# Altium schematic sheet Watch Design_2022-04-19.schdoc
size 423 x 188 mm
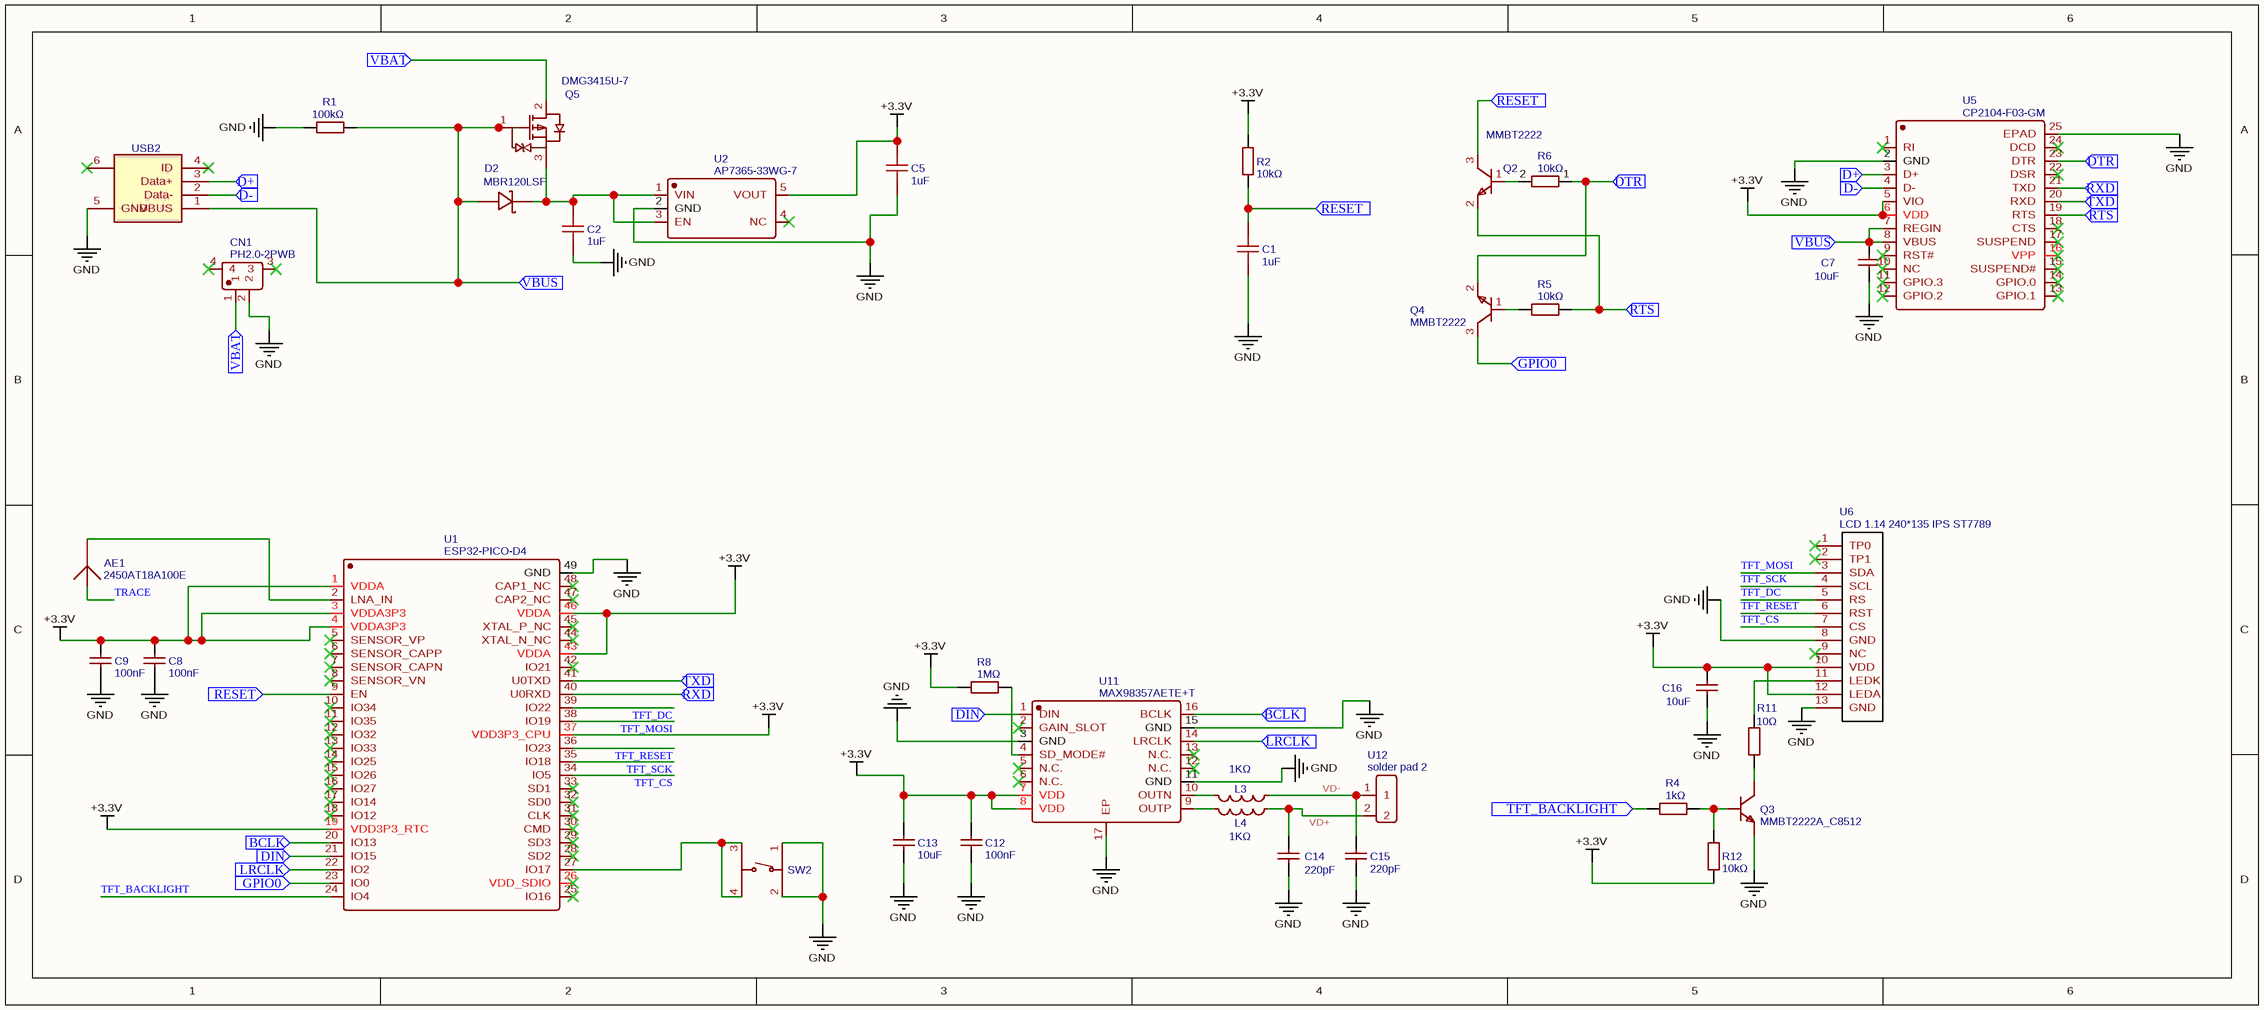
[diagram p0: Watch Design_2022-04-19.schdoc]

## Parts
AE1  2450AT18A100E  [ANT-SMD_L3.2-W1.6]
C1  1uF  [C0603]
C2  1uF  [C0402]
C5  1uF  [C0402]
C7  10uF  [C0402]
C8  100nF  [C0402]
C9  100nF  [C0402]
C12  100nF  [C0402]
C13  10uF  [C0402]
C14  220pF  [C0402]
C15  220pF  [C0402]
C16  10uF  [C0402]
CN1  PH2.0-2PWB  [CONN-SMD_2P-P2.00_PH2.0-SPWB]
D2  MBR120LSF  [SOD-123_L2.8-W1.8-LS3.7-RD]
L3  1KΩ  [L0603]
L4  1KΩ  [L0603]
Q2  MMBT2222  [SOT-23-3_L2.9-W1.4-P1.91-LS2.6-BR]
Q3  MMBT2222A_C8512  [SOT-23-3_L2.9-W1.3-P1.90-LS2.4-BR]
Q4  MMBT2222  [SOT-23-3_L2.9-W1.4-P1.91-LS2.6-BR]
Q5  DMG3415U-7  [SOT-23-3_L2.9-W1.6-P1.90-LS2.8-BR-CW]
R1  100kΩ  [R0402]
R2  10kΩ  [R0402]
R4  1kΩ  [R0402]
R5  10kΩ  [R0402]
R6  10kΩ  [R0402]
R8  1MΩ  [R0402]
R11  10Ω  [R0402]
R12  10kΩ  [R0402]
SW2  TS-1187A-B-A-B  [SW-SMD_4P-L5.1-W5.1-P3.70-LS6.5-TL-2]  (value not drawn)
U1  ESP32-PICO-D4  [QFN-48_L7.0-W7.0-P0.50-BL-EP5.4]
U2  AP7365-33WG-7  [SOT-25_L3.0-W1.6-P0.95-LS2.8-BR]
U5  CP2104-F03-GM  [QFN-24_L4.0-W4.0-P0.50-BL-EP2.7]
U6  LCD 1.14 240*135 IPS ST7789  [LCD_1.14_240*135_IPS_ST7789]
U11  MAX98357AETE+T  [TQFN-16_L3.0-W3.0-P0.50-BL-EP1.5]
U12  solder pad 2  [SOLDER PADS]
USB2  47346-0001  [MICRO-USB-SMD_47346-0001]  (value not drawn)

## Ports
BCLK (in), D+ (in), D- (in), DIN (in), DTR (in), GPIO0 (in), LRCLK (in), RESET (in), RTS (in), RXD (in), TFT_BACKLIGHT (in), TXD (in), VBAT (in), VBUS (in)

## Nets
+3.3V: C5.2 C8.2 C9.2 C12.2 C13.2 C16.2 R2.2 R8.1 R12.1 U1.1(VDDA) U1.3(VDDA3P3) U1.4(VDDA3P3) U1.19(VDD3P3_RTC) U1.37(VDD3P3_CPU) U1.43(VDDA) U1.46(VDDA) U2.5(VOUT) U5.5(VIO) U5.6(VDD) U6.10(VDD) U6.12(LEDA) U11.7(VDD) U11.8(VDD)
GND: C1.1 C2.1 C5.1 C7.1 C8.1 C9.1 C12.1 C13.1 C14.1 C15.1 C16.1 CN1.2 Q3.2(E) R1.1 SW2.1(A) SW2.2(B) U1.49(GND) U2.2(GND) U5.2(GND) U5.25(EPAD) U6.8(GND) U6.13(GND) U11.3(GND) U11.11(GND) U11.15(GND) U11.17(EP) USB2.5(GND)
BCLK: U1.20(IO13) U11.16(BCLK) ; port BCLK
D+: U5.3(D+) USB2.3(Data+) ; port D+
D-: U5.4(D-) USB2.2(Data-) ; port D-
DIN: U1.21(IO15) U11.1(DIN) ; port DIN
DTR: Q4.2(E) R6.1 U5.23(DTR) ; port DTR
GPIO0: Q4.3(C) U1.23(IO0) ; port GPIO0
LRCLK: U1.22(IO2) U11.14(LRCLK) ; port LRCLK
RESET: C1.2 Q2.3(C) R2.1 U1.9(EN) ; port RESET
RTS: Q2.2(E) R5.1 U5.19(RTS) ; port RTS
RXD: U1.40(U0RXD) U5.21(TXD) ; port RXD
TFT_BACKLIGHT: U1.24(IO4)
TFT_BACKLIGHT: R4.1 ; port TFT_BACKLIGHT  [a separate net that carries the same name]
TFT_CS: U1.34(IO5) U6.7(CS)
TFT_DC: U1.39(IO22) U6.5(RS)
TFT_MOSI: U1.38(IO19) U6.3(SDA)
TFT_RESET: U1.36(IO23) U6.6(RST)
TFT_SCK: U1.35(IO18) U6.4(SCL)
TRACE: AE1.2
TXD: U1.41(U0TXD) U5.20(RXD) ; port TXD
VBAT: CN1.1 Q5.2(D) ; port VBAT
VBUS: C7.2 D2.2(A) Q5.1(G) R1.2 U5.7(REGIN) U5.8(VBUS) USB2.1(VBUS) ; port VBUS
NetAE1_1: AE1.1(ANT) U1.2(LNA_IN)
NetC2_2: C2.2 D2.1(C) Q5.3(S) U2.1(VIN) U2.3(EN)
NetC14_2: C14.2 L4.1 U12.2
NetC15_2: C15.2 L3.1 U12.1
NetL3_2: L3.2 U11.10(OUTN)
NetL4_2: L4.2 U11.9(OUTP)
NetQ2_1: Q2.1(B) R6.2
NetQ3_1: Q3.1(B) R4.2 R12.2
NetQ3_3: Q3.3(C) R11.1
NetQ4_1: Q4.1(B) R5.2
NetR8_2: R8.2 U11.4(SD_MODE#)
NetR11_2: R11.2 U6.11(LEDK)
NetSW2_3: SW2.3(C) SW2.4(D) U1.27(IO17)

Not connected (* = marked no-connect by the designer): CN1 3* 4*; U1 5(SENSOR_VP)* 6(SENSOR_CAPP)* 7(SENSOR_CAPN)* 8(SENSOR_VN)* 10(IO34)* 11(IO35)* 12(IO32)* 13(IO33)* 14(IO25)* 15(IO26)* 16(IO27)* 17(IO14)* 18(IO12)* 25(IO16)* 26(VDD_SDIO)* 28(SD2)* 29(SD3)* 30(CMD)* 31(CLK)* 32(SD0)* 33(SD1)* 42(IO21)* 44(XTAL_N_NC)* 45(XTAL_P_NC)* 47(CAP2_NC)* 48(CAP1_NC)*; U2 4(NC)*; U5 1(RI)* 9(RST#)* 10(NC)* 11(GPIO.3)* 12(GPIO.2)* 13(GPIO.1)* 14(GPIO.0)* 15(SUSPEND#)* 16(VPP)* 17(SUSPEND)* 18(CTS)* 22(DSR)* 24(DCD)*; U6 1(TP0)* 2(TP1)* 9(NC)*; U11 2(GAIN_SLOT)* 5(N.C.)* 6(N.C.)* 12(N.C.)* 13(N.C.)*; USB2 4(ID)* 6*

## Notes on the sheet
- VD+
- VD-

## Library data of the parts
AE1 = 2450AT18A100E: BOM_Manufacturer: Johanson Dielectrics; Contributor: LCSC; BOM_Supplier: LCSC; BOM_Supplier Part: C89334; BOM_Manufacturer Part: 2450AT18A100E; BOM_JLCPCB Part Class: Extended Part; spicePre: A; spiceSymbolName: 2450AT18A100E
C1 = 1uF: BOM_Manufacturer: Samwha Capacitor; BOM_Manufacturer Part: CS1608X7R105K250NRB; nameAlias: Capacitance; Contributor: LCSC; BOM_Supplier: LCSC; BOM_Supplier Part: C513775; BOM_JLCPCB Part Class: Extended Part; spicePre: C; spiceSymbolName: CS1608X7R105K250NRB
C2 C5 = 1uF: BOM_Manufacturer: Walsin Tech Corp; BOM_Manufacturer Part: 0402F105M6R3CT; nameAlias: Capacitance; Contributor: LCSC; BOM_Supplier: LCSC; BOM_Supplier Part: C408910; BOM_JLCPCB Part Class: Extended Part; spicePre: C; spiceSymbolName: 0402F105M6R3CT
C7 C13 C16 = 10uF: BOM_Manufacturer Part: CL05A106MQ5NUNC; BOM_Manufacturer: SAMSUNG; nameAlias: Capacitance; BOM_Supplier: LCSC; BOM_Supplier Part: C15525; BOM_JLCPCB Part Class: Basic Part; spicePre: C; spiceSymbolName: CL05A106MQ5NUNC
C8 C9 C12 = 100nF: BOM_Manufacturer: FH; BOM_Manufacturer Part: 0402F104M500NT; nameAlias: Capacitance; BOM_Supplier: LCSC; BOM_Supplier Part: C1581; BOM_JLCPCB Part Class: Extended Part; spicePre: C; spiceSymbolName: 0402F104M500NT
C14 C15 = 220pF: BOM_Manufacturer: FH; BOM_Manufacturer Part: 0402B221K500NT; nameAlias: Capacitance; BOM_Supplier: LCSC; BOM_Supplier Part: C1530; BOM_JLCPCB Part Class: Basic Part; spicePre: C; spiceSymbolName: 0402B221K500NT
CN1 = PH2.0-2PWB: BOM_Manufacturer: BOOMELE; BOM_Manufacturer Part: PH2.0-2PWB Horizontal; BOM_Supplier: LCSC; BOM_Supplier Part: C47647; BOM_JLCPCB Part Class: Extended Part; spicePre: C; spiceSymbolName: PH2.0-2PWB
D2 = MBR120LSF: BOM_Manufacturer: SK; Contributor: LCSC; BOM_Supplier: LCSC; BOM_Manufacturer Part: MBR120LSF; BOM_Supplier Part: C130880; BOM_JLCPCB Part Class: Extended Part; spicePre: D; spiceSymbolName: MBR120LSF
L3 L4 = 1KΩ: BOM_Manufacturer: MuRata; BOM_Manufacturer Part: BLM18AG102SN1D; nameAlias: Value; BOM_Supplier: LCSC; BOM_Supplier Part: C85824; BOM_JLCPCB Part Class: Extended Part; spicePre: L; spiceSymbolName: BLM18AG102SN1D
Q2 Q4 = MMBT2222: BOM_Manufacturer: YONGYUTAI(永裕泰); Contributor: LCSC; BOM_Supplier: LCSC; BOM_Supplier Part: C2891810; BOM_Manufacturer Part: MMBT2222; spicePre: Q; spiceSymbolName: MMBT2222
Q3 = MMBT2222A_C8512: BOM_Manufacturer: CJ; BOM_Supplier: LCSC; BOM_Manufacturer Part: MMBT2222A; BOM_Supplier Part: C8512; BOM_JLCPCB Part Class: Basic Part; spicePre: Q; spiceSymbolName: MMBT2222A_C8512
Q5 = DMG3415U-7: BOM_Manufacturer: Diodes Incorporated; Contributor: LCSC; BOM_Supplier: LCSC; BOM_Supplier Part: C96616; BOM_Manufacturer Part: DMG3415U-7; BOM_JLCPCB Part Class: Extended Part; spicePre: Q; spiceSymbolName: DMG3415U-7
R1 = 100kΩ: BOM_Manufacturer: UniOhm; BOM_Manufacturer Part: 0402WGF1003TCE; nameAlias: Resistance; Resistance (Ohms): 100K; BOM_Supplier: LCSC; BOM_Supplier Part: C25741; BOM_JLCPCB Part Class: Basic Part; spicePre: R; spiceSymbolName: 0402WGF1003TCE
R2 R5 R6 R12 = 10kΩ: BOM_Manufacturer: UniOhm; BOM_Manufacturer Part: 0402WGF1002TCE; nameAlias: Resistance; Resistance (Ohms): 10K; BOM_Supplier: LCSC; BOM_Supplier Part: C25744; BOM_JLCPCB Part Class: Basic Part; spicePre: R; spiceSymbolName: 0402WGF1002TCE
R4 = 1kΩ: BOM_Manufacturer: UniOhm; BOM_Manufacturer Part: 0402WGF1001TCE; nameAlias: Resistance; Resistance (Ohms): 1K; BOM_Supplier: LCSC; BOM_Supplier Part: C11702; BOM_JLCPCB Part Class: Basic Part; spicePre: R; spiceSymbolName: 0402WGF1001TCE
R8 = 1MΩ: BOM_Manufacturer: UniOhm; BOM_Manufacturer Part: 0402WGF1004TCE; nameAlias: Resistance; Resistance (Ohms): 1M; BOM_Supplier: LCSC; BOM_Supplier Part: C26083; BOM_JLCPCB Part Class: Basic Part; spicePre: R; spiceSymbolName: 0402WGF1004TCE
R11 = 10Ω: BOM_Manufacturer: UniOhm; BOM_Manufacturer Part: 0402WGF100JTCE; nameAlias: Resistance; Resistance (Ohms): 10; BOM_Supplier: LCSC; BOM_Supplier Part: C25077; BOM_JLCPCB Part Class: Basic Part; spicePre: R; spiceSymbolName: 0402WGF100JTCE
SW2 = TS-1187A-B-A-B: BOM_Manufacturer: XKB Enterprise; Contributor: LCSC; BOM_Supplier: LCSC; BOM_Supplier Part: C318884; BOM_Manufacturer Part: TS-1187A-B-A-B; BOM_JLCPCB Part Class: Basic Part; spicePre: S; spiceSymbolName: TS-1187A-B-A-B
U1 = ESP32-PICO-D4: BOM_Manufacturer: Espressif Systems; Contributor: LCSC; BOM_Supplier: LCSC; BOM_Supplier Part: C193707; BOM_Manufacturer Part: ESP32-PICO-D4; BOM_JLCPCB Part Class: Extended Part; Frequency: -; spicePre: U; spiceSymbolName: ESP32-PICO-D4
U2 = AP7365-33WG-7: BOM_Manufacturer: DIODES; Contributor: LCSC; BOM_Supplier: LCSC; BOM_Manufacturer Part: AP7365-33WG-7; BOM_Supplier Part: C150742; BOM_JLCPCB Part Class: Extended Part; spicePre: U; spiceSymbolName: AP7365-33WG-7
U5 = CP2104-F03-GM: BOM_Manufacturer: SILICON LABS; BOM_Supplier: LCSC; BOM_Manufacturer Part: CP2104-F03-GM; BOM_Supplier Part: C47742; BOM_JLCPCB Part Class: Extended Part; spicePre: U; spiceSymbolName: CP2104-F03-GM
U6 = LCD 1.14 240*135 IPS ST7789: BOM_Manufacturer Part: IPS 160x80 ST7735; Contributor: pagercam; BOM_Supplier: East Rising; link: https://ru.aliexpress.com/item/32861823719.html; spicePre: U; spiceSymbolName: LCD 1.14 240*135 IPS ST7789
U11 = MAX98357AETE+T: BOM_Manufacturer: MAXIM(美信); Contributor: LCSC; BOM_Supplier: LCSC; BOM_Supplier Part: C910544; BOM_Manufacturer Part: MAX98357AETE+T; BOM_JLCPCB Part Class: Extended Part; spicePre: U; spiceSymbolName: MAX98357AETE+T
U12 = solder pad 2: Contributor: ravindukathri; BOM_Manufacturer Part: Solder Pads; spicePre: U; spiceSymbolName: solder pad 2
USB2 = 47346-0001: BOM_Manufacturer: MOLEX; Contributor: LCSC; BOM_Supplier: LCSC; BOM_Supplier Part: C132560; BOM_Manufacturer Part: 47346-0001; BOM_JLCPCB Part Class: Extended Part; spicePre: U; spiceSymbolName: 47346-0001